# EAGLE schematic secs_q84 v2 (EAGLE 9.6.2)
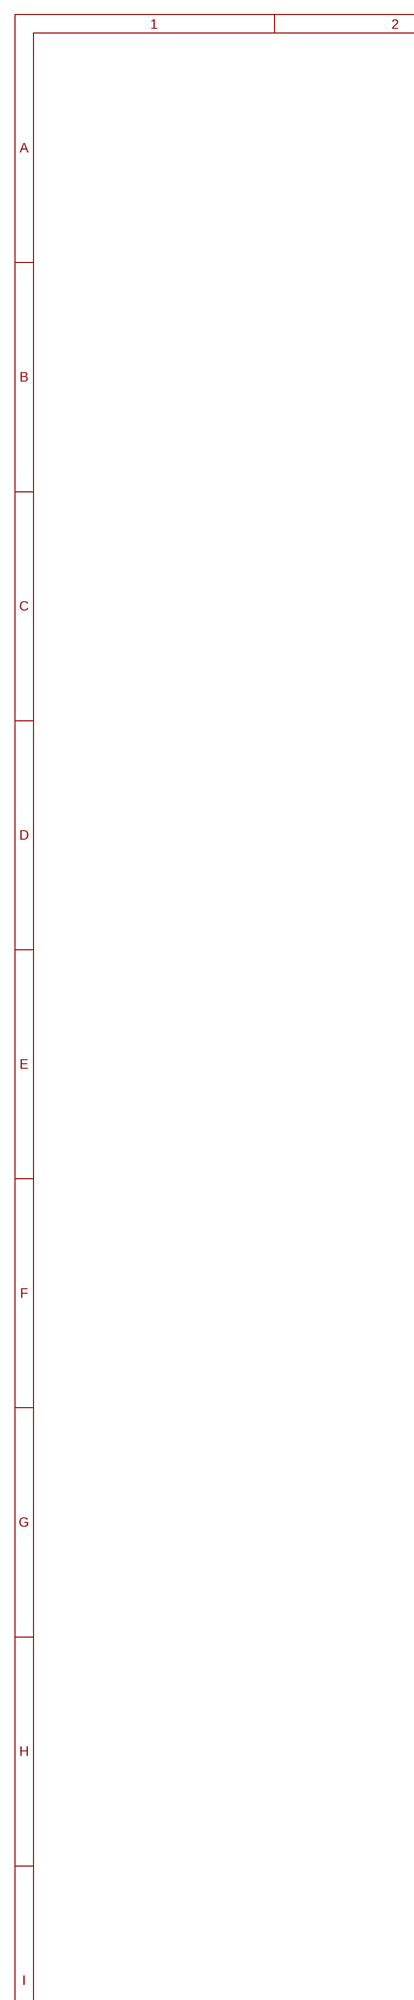
[diagram p0: schematic, sheet 1, part 1 of 2]
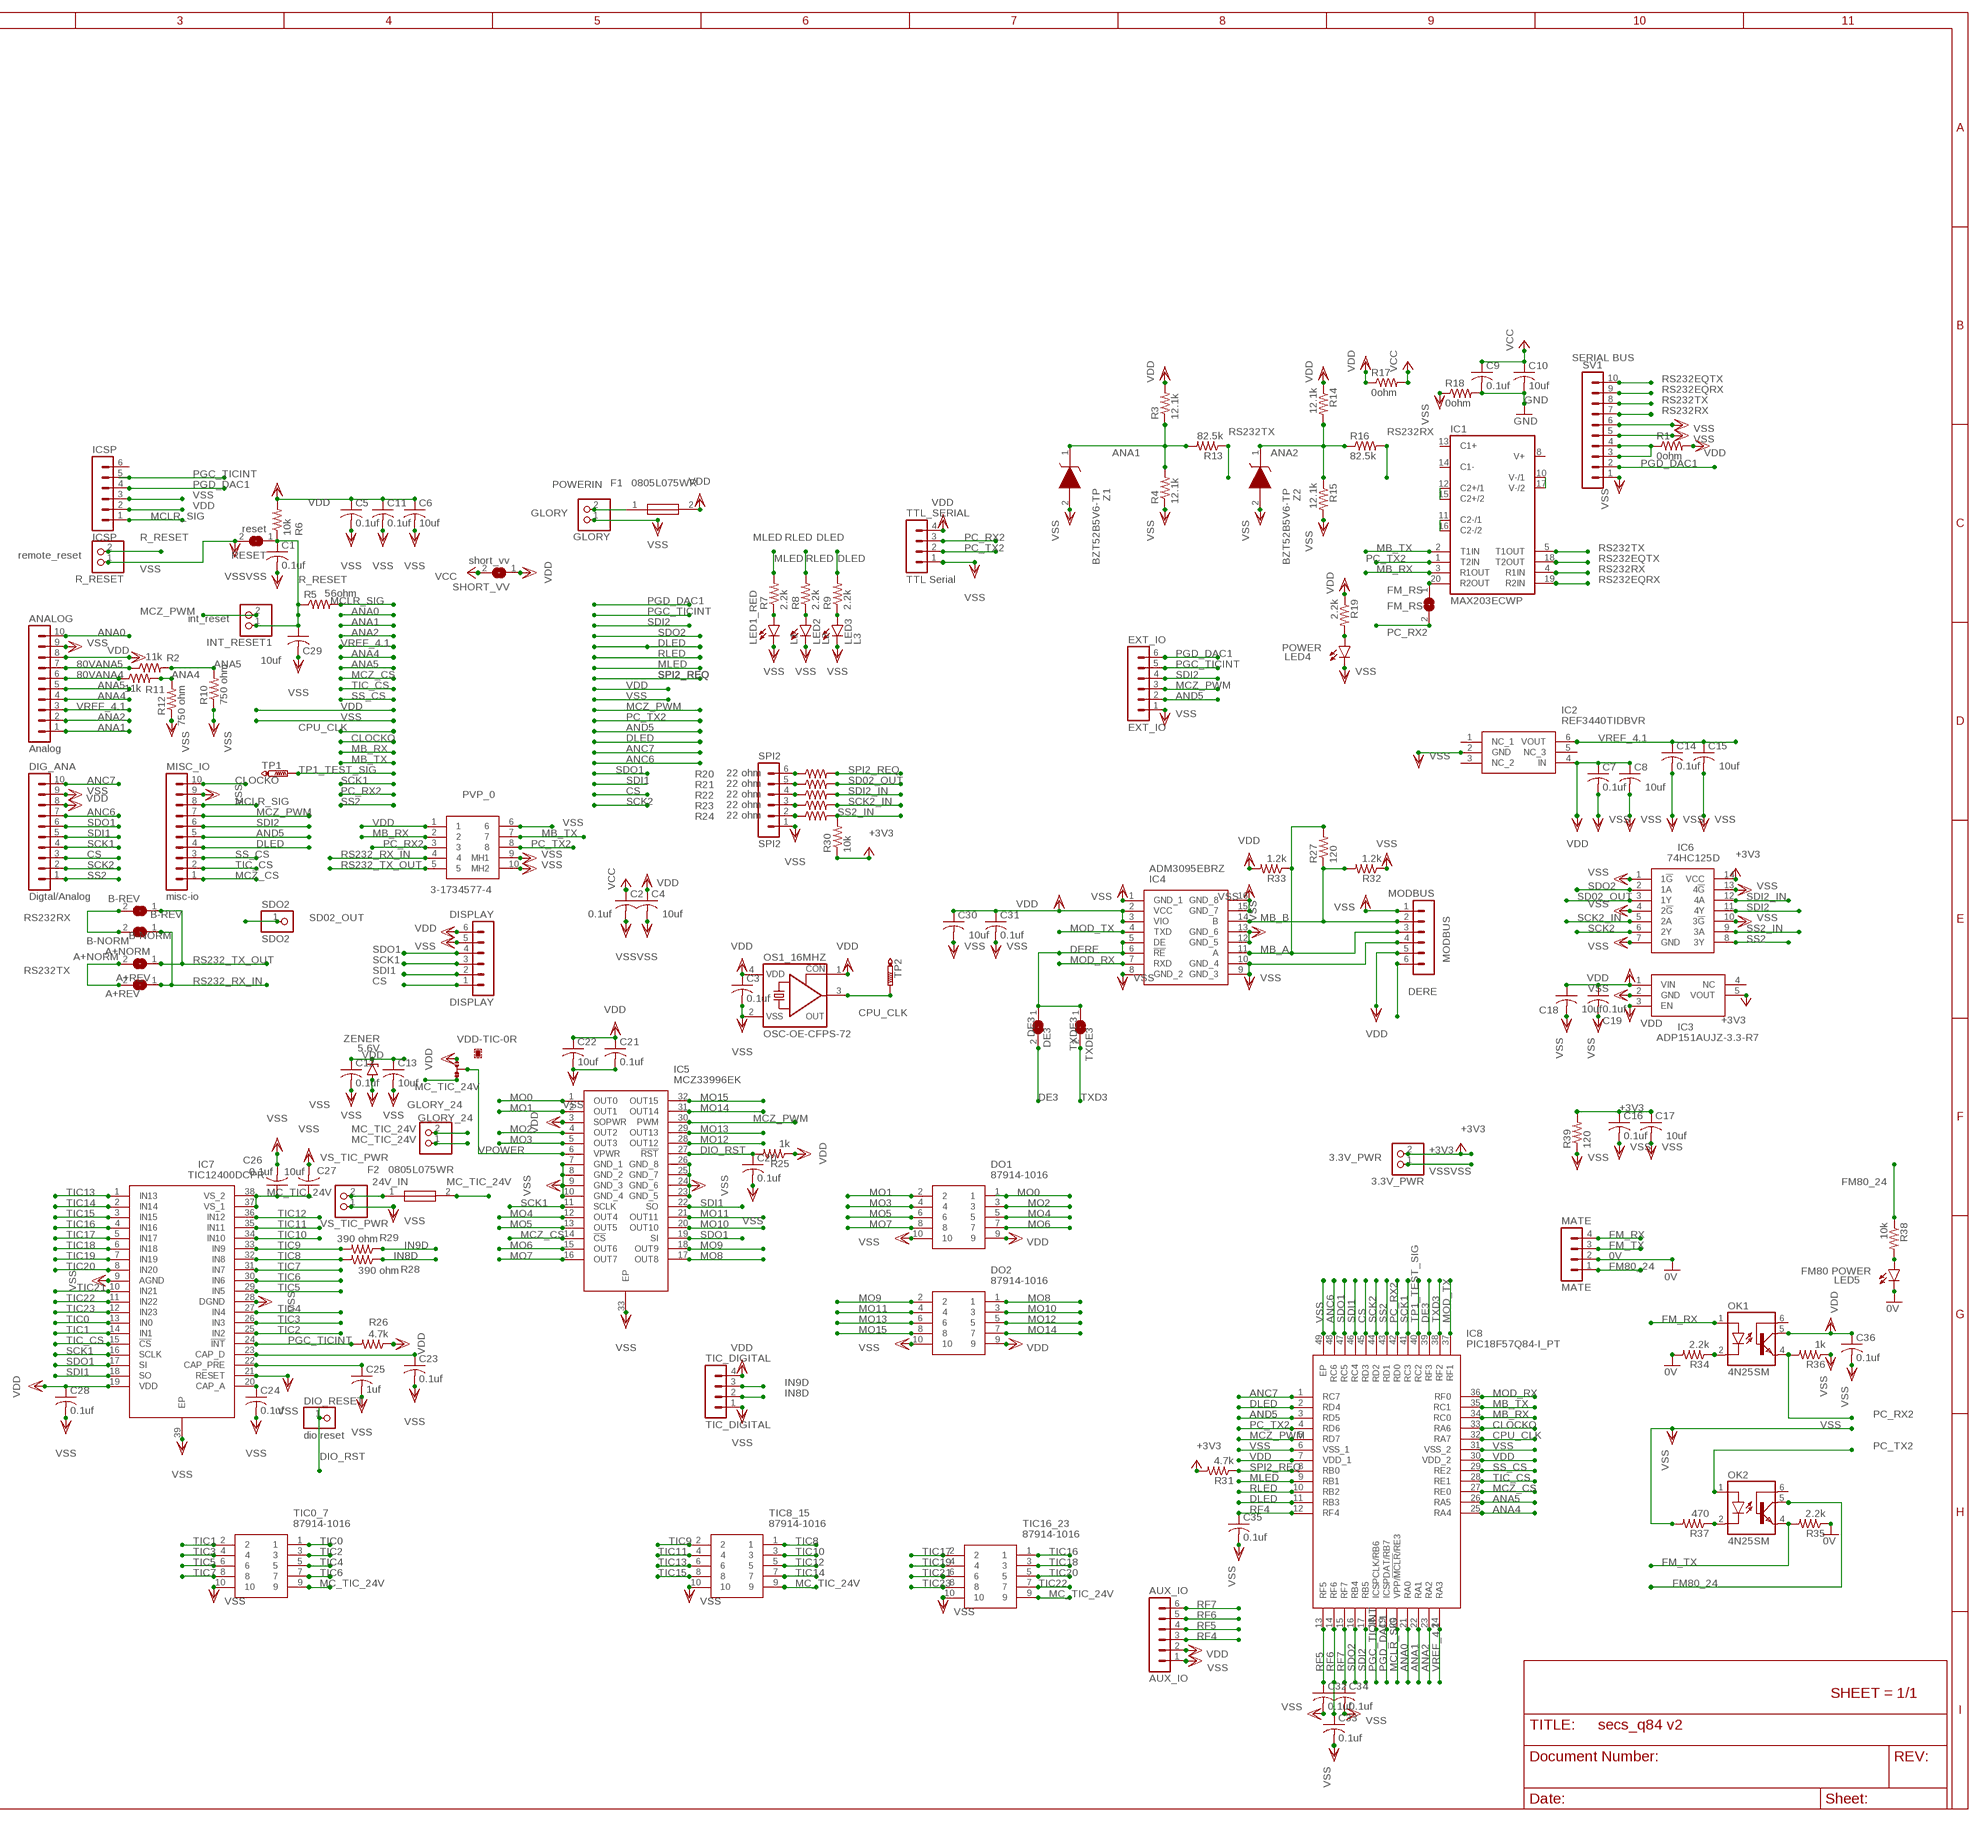
[diagram p1: schematic, sheet 1, part 2 of 2]

## Parts
3.3V_PWR  3.3V_PWR  PINHD-1X2  [1X02]
A+NORM  A+NORM  SJ  [SJ]
A+REV  A+REV  SJ  [SJ]
ANALOG  Analog  MA10-1  [MA10-1]
AUX_IO  AUX_IO  MA06-1  [MA06-1]
B-NORM  B-NORM  SJ  [SJ]
B-REV  B-REV  SJ  [SJ]
C1  0.1uf  C-USC0805  [C0805]
C2  0.1uf  C-USC0805  [C0805]
C3  0.1uf  C-USC0805  [C0805]
C4  10uf  C-USC0805  [C0805]
C5  0.1uf  C-USC0805  [C0805]
C6  10uf  C-USC0805  [C0805]
C7  0.1uf  C-USC0805  [C0805]
C8  10uf  C-USC0805  [C0805]
C9  0.1uf  C-USC0805  [C0805]
C10  10uf  C-USC0805  [C0805]
C11  0.1uf  C-USC0805  [C0805]
C12  0.1uf  C-USC0805  [C0805]
C13  10uf  C-USC0805  [C0805]
C14  0.1uf  C-USC0805  [C0805]
C15  10uf  C-USC0805  [C0805]
C16  0.1uf  C-USC0805  [C0805]
C17  10uf  C-USC0805  [C0805]
C18  10uf  C-USC0805  [C0805]
C19  0.1uf  C-USC0805  [C0805]
C20  0.1uf  C-USC0805  [C0805]
C21  0.1uf  C-USC0805  [C0805]
C22  10uf  C-USC0805  [C0805]
C23  0.1uf  C-USC0805  [C0805]
C24  0.1uf  C-USC0805  [C0805]
C25  1uf  C-USC0805  [C0805]
C26  0.1uf  C-USC0805  [C0805]
C27  10uf  C-USC0805  [C0805]
C28  0.1uf  C-USC0805  [C0805]
C29  10uf  C-USC0805  [C0805]
C30  10uf  C-USC0805  [C0805]
C31  0.1uf  C-USC0805  [C0805]
C32  0.1uf  C-USC0603  [C0603]
C33  0.1uf  C-USC0603  [C0603]
C34  0.1uf  C-USC0603  [C0603]
C35  0.1uf  C-USC0603  [C0603]
C36  0.1uf  C-USC0603  [C0603]
DE3  DE3  SJ  [SJ]
DIG_ANA  Digtal/Analog  MA10-1  [MA10-1]
DIO_RESET  dio reset  PINHD-1X1  [1X01]
DISPLAY  DISPLAY  MA06-1  [MA06-1]
DO1  87914-1016  [879141016]
DO2  87914-1016  [879141016]
EXT_IO  EXT_IO  MA06-1  [MA06-1]
F1  0805L075WR  [FUSC2114X125N]
F2  0805L075WR  [FUSC2114X125N]
FM_RS  FM_RS  SJ  [SJ]
GLORY  GLORY  PINHD-1X2  [1X02]
GLORY_24  GLORY_24  PINHD-1X2  [1X02]
IC1  MAX203ECWP  [SO20L]
IC2  REF3440TIDBVR  [SOT95P280X145-6N]
IC3  ADP151AUJZ-3.3-R7  [SOT95P280X100-5N]
IC4  ADM3095EBRZ  [SOIC127P600X175-16N]
IC5  MCZ33996EK  [SOP65P1030X265-33N]
IC6  74HC125D  [SOIC127P600X175-14N]
IC7  TIC12400DCPR  [SOP50P640X120-39N]
IC8  PIC18F57Q84-I_PT  [QFP50P900X900X120-49N]
ICSP  ICSP  MA06-1  [MA06-1]
INT_RESET1  int_reset  PINHD-1X2  [1X02]
LED1_RED  L1  LEDCHIPLED_0805  [CHIPLED_0805]
LED2  L2  LEDCHIPLED_0805  [CHIPLED_0805]
LED3  L3  LEDCHIPLED_0805  [CHIPLED_0805]
LED4  POWER  LEDCHIP-LED0603  [CHIP-LED0603]
LED5  FM80 POWER  LEDCHIP-LED0603  [CHIP-LED0603]
MATE  MATE  MA04-1  [MA04-1]
MISC_IO  misc-io  MA10-1  [MA10-1]
MODBUS  MODBUS  MA06-1  [MA06-1]
OK1  4N25SM  [DIL6-SMD]
OK2  4N25SM  [DIL6-SMD]
OS1_16MHZ  OSC-OE-CFPS-72  [7.2X5.2-4-PAD]
PVP_0  3-1734577-4  [317345774]
R1  0ohm  R-US_R0805  [R0805]
R2  11k  R-US_M1206  [M1206]
R3  12.1k  R-US_R0805  [R0805]
R4  12.1k  R-US_R0805  [R0805]
R5  56ohm  R-US_R0805  [R0805]
R6  10k  R-US_R0805  [R0805]
R7  2.2k  R-US_R0805  [R0805]
R8  2.2k  R-US_R0805  [R0805]
R9  2.2k  R-US_R0805  [R0805]
R10  750 ohm  R-US_M1206  [M1206]
R11  11k  R-US_M1206  [M1206]
R12  750 ohm  R-US_M1206  [M1206]
R13  82.5k  R-US_R0805  [R0805]
R14  12.1k  R-US_R0805  [R0805]
R15  12.1k  R-US_R0805  [R0805]
R16  82.5k  R-US_R0805  [R0805]
R17  0ohm  R-US_R0805  [R0805]
R18  0ohm  R-US_R0805  [R0805]
R19  2.2k  R-US_R0805  [R0805]
R20  22 ohm  R-US_R0805  [R0805]
R21  22 ohm  R-US_R0805  [R0805]
R22  22 ohm  R-US_R0805  [R0805]
R23  22 ohm  R-US_R0805  [R0805]
R24  22 ohm  R-US_R0805  [R0805]
R25  1k  R-US_R0805  [R0805]
R26  4.7k  R-US_R0805  [R0805]
R27  120  R-US_R0805  [R0805]
R28  390 ohm  R-US_R0805  [R0805]
R29  390 ohm  R-US_R0805  [R0805]
R30  10k  R-US_R0805  [R0805]
R31  4.7k  R-US_R0805  [R0805]
R32  1.2k  R-US_R0805  [R0805]
R33  1.2k  R-US_R0805  [R0805]
R34  2.2k  R-US_R0805  [R0805]
R35  2.2k  R-US_R0805  [R0805]
R36  1k  R-US_R0805  [R0805]
R37  470  R-US_R0805  [R0805]
R38  10k  R-US_R0805  [R0805]
R39  120  R-US_R0805  [R0805]
R_RESET  remote_reset  PINHD-1X2  [1X02]
RESET  reset  SJ  [SJ]
SDO2  SDO2  PINHD-1X1  [1X01]
SHORT_VV  short_vv  SJ  [SJ]
SPI2  SPI2  MA06-1  [MA06-1]
SV1  SERIAL BUS  MA10-1  [MA10-1]
TIC0_7  87914-1016  [879141016]
TIC8_15  87914-1016  [879141016]
TIC16_23  87914-1016  [879141016]
TIC_DIGITAL  TIC_DIGITAL  MA04-1  [MA04-1]
TP1  PTR1PAD1-13  [P1-13]
TP2  PTR1PAD1-13  [P1-13]
TTL_SERIAL  TTL Serial  MA04-1  [MA04-1]
TXDE3  TXDE3  SJ  [SJ]
VDD-TIC  0R-JUMPA  [A0R-JMP]
VS_TIC_PWR  VS_TIC_PWR  PINHD-1X2  [1X02]
Z1  BZT52B5V6-TP  [SOD3716X135N]
Z2  BZT52B5V6-TP  [SOD3716X135N]
ZENER  5.6V  ZENER-DIODESMB  [SMB]

## Nets
0V: LED5.C MATE.2 R34.2 R35.1
24V_IN [icurrent]: F2.1 VS_TIC_PWR.2
80VANA4: ANALOG.6 R11.1
80VANA5: ANALOG.7 R2.1
+3V3: 3.3V_PWR.2 C16.1 C17.1 IC3.5(VOUT) IC6.14(VCC) R30.1 R31.2 R39.2
ANA0: ANALOG.10 IC8.21(RA0)
ANA1: ANALOG.1 IC8.22(RA1) R3.1 R4.2 R13.2 Z1.1(K)
ANA2: ANALOG.2 IC8.23(RA2) R14.2 R15.1 R16.1 Z2.1(K)
ANA4: ANALOG.4 IC8.25(RA4) R11.2 R12.2
ANA5: ANALOG.5 IC8.26(RA5) R2.2 R10.2
ANC6: DIG_ANA.7 IC8.48(RC6)
ANC7: DIG_ANA.10 IC8.1(RC7)
AND5: EXT_IO.2 IC8.3(RD5) MISC_IO.5
CLOCKO: IC8.33(RA6) MISC_IO.10
CPU_CLK: IC8.32(RA7) OS1_16MHZ.3(OUT) TP2.TP
CS: DIG_ANA.3 DISPLAY.1 IC8.45(RD3)
DE3: DE3.2 IC8.39(RF3)
DERE: DE3.1 IC4.5(DE) IC4.6(!RE) MODBUS.6 TXDE3.1
DIO_RST: C20.1 DIO_RESET.1 IC5.27(!RST) R25.2
DLED: IC8.2(RD4) IC8.11(RB3) MISC_IO.4 R9.2
DPOWER [icurrent]: R1.1 SV1.3 SV1.4
FM80_24: MATE.1 OK2.5(COL) R38.1
FM_RX: MATE.4 OK1.1(A)
FM_TX: MATE.3 OK2.4(EMI) R35.2
GND [icurrent]: C9.2 C10.2 R18.2
IN8D: R28.1 TIC_DIGITAL.2
IN9D: R29.1 TIC_DIGITAL.3
MB_A: IC4.11(A) MODBUS.3 R27.2 R33.1
MB_B: IC4.14(B) MODBUS.2 R27.1 R32.2
MB_RX: IC1.3(R1OUT) IC8.34(RC0) PVP_0.2
MB_TX: IC1.2(T1IN) IC8.35(RC1) PVP_0.7
MC_TIC_24V [icurrent]: C26.1 C27.1 F2.2 GLORY_24.1 GLORY_24.2 IC7.37(VS_1) IC7.38(VS_2) TIC0_7.9 TIC8_15.9 TIC16_23.9 VDD-TIC.3
MCLR_SIG: IC8.20(VPP/!MCLR!/RE3) ICSP.1 MISC_IO.8 R5.2
MCZ_CS: IC5.14(!CS) IC8.27(RE0) MISC_IO.1
MCZ_PWM: EXT_IO.3 IC5.30(PWM) IC8.5(RD7) INT_RESET1.2 MISC_IO.7
MLED: IC8.9(RB1) R7.2
MO0 [ocurrent]: DO1.1 IC5.1(OUT0)
MO1 [ocurrent]: DO1.2 IC5.2(OUT1)
MO2 [ocurrent]: DO1.3 IC5.4(OUT2)
MO3 [ocurrent]: DO1.4 IC5.5(OUT3)
MO4 [ocurrent]: DO1.5 IC5.12(OUT4)
MO5 [ocurrent]: DO1.6 IC5.13(OUT5)
MO6 [ocurrent]: DO1.7 IC5.15(OUT6)
MO7 [ocurrent]: DO1.8 IC5.16(OUT7)
MO8 [ocurrent]: DO2.1 IC5.17(OUT8)
MO9 [ocurrent]: DO2.2 IC5.18(OUT9)
MO10 [ocurrent]: DO2.3 IC5.20(OUT10)
MO11 [ocurrent]: DO2.4 IC5.21(OUT11)
MO12 [ocurrent]: DO2.5 IC5.28(OUT12)
MO13 [ocurrent]: DO2.6 IC5.29(OUT13)
MO14 [ocurrent]: DO2.7 IC5.31(OUT14)
MO15 [ocurrent]: DO2.8 IC5.32(OUT15)
MOD_RX: IC4.7(RXD) IC8.36(RF0)
MOD_TX: IC4.4(TXD) IC8.37(RF1)
N$1: IC1.10(V-/1) IC1.17(V-/2)
N$2: IC1.12(C2+/1) IC1.15(C2+/2)
N$3: LED4.A R19.2
N$4: LED1_RED.A R7.1
N$5: LED2.A R8.1
N$6: LED3.A R9.1
N$7: IC1.11(C2-/1) IC1.16(C2-/2)
N$8: R20.1 SPI2.6
N$9: R21.1 SPI2.5
N$10: R22.1 SPI2.4
N$11: R23.1 SPI2.3
N$12: R24.1 SPI2.2
N$13: FM_RS.1 IC1.20(R2OUT)
N$14: OK1.2(C) R34.1
N$15: LED5.A R38.2
N$17: OK2.2(C) R37.1
N$30: C23.1 IC7.23(CAP_D)
N$31: C25.1 IC7.22(CAP_PRE)
N$32: C24.1 IC7.20(CAP_A)
PC_RX2: FM_RS.2 IC8.42(RD0) OK1.4(EMI) PVP_0.3 R36.2 TTL_SERIAL.3
PC_TX2: IC1.1(T2IN) IC8.4(RD6) OK2.1(A) PVP_0.8 TTL_SERIAL.2
PGC_TICINT: EXT_IO.5 IC7.24(!INT) IC8.18(ICSPCLK/RB6) ICSP.5 R26.2
PGD_DAC1: EXT_IO.6 IC8.19(ICSPDAT/RB7) ICSP.4 SV1.2
POWERIN [icurrent]: F1.1 GLORY.2
R_RESET: C1.1 C29.1 INT_RESET1.1 R5.1 R6.1 R_RESET.2 RESET.1
RF4: AUX_IO.3 C35.1 IC8.12(RF4)
RF5: AUX_IO.4 C32.1 IC8.13(RF5)
RF6: AUX_IO.5 C33.1 IC8.14(RF6)
RF7: AUX_IO.6 C34.1 IC8.15(RF7)
RLED: IC8.10(RB2) R8.2
RS232_RX_IN: A+REV.1 B-NORM.1 PVP_0.4
RS232_TX_OUT: A+NORM.1 B-REV.1 PVP_0.5
RS232EQRX: IC1.19(R2IN) SV1.9
RS232EQTX: IC1.18(T2OUT) SV1.10
RS232RX: B-NORM.2 B-REV.2 IC1.4(R1IN) R16.2 SV1.7
RS232TX: A+NORM.2 A+REV.2 IC1.5(T1OUT) R13.1 SV1.8
SCK1: DIG_ANA.4 DISPLAY.3 IC5.11(SCLK) IC7.16(SCLK) IC8.41(RC3)
SCK2: DIG_ANA.2 IC6.6(2Y) IC8.44(RD2)
SCK2_IN: IC6.5(2A) R23.2
SD02_OUT: IC6.3(1Y) R21.2 SDO2.1
SDI1: DIG_ANA.5 DISPLAY.2 IC5.22(SO) IC7.18(SO) IC8.46(RC4)
SDI2: EXT_IO.4 IC6.11(4Y) IC8.17(RB5) MISC_IO.6
SDI2_IN: IC6.12(4A) R22.2
SDO1: DIG_ANA.6 DISPLAY.4 IC5.19(SI) IC7.17(SI) IC8.47(RC5)
SDO2: IC6.2(1A) IC8.16(RB4)
SPI2_REQ: IC8.8(RB0) R20.2 R31.1
SS2: DIG_ANA.1 IC6.8(3Y) IC8.43(RD1)
SS2_IN: IC6.9(3A) R24.2 R30.2
SS_CS: IC8.29(RE2) MISC_IO.3
TIC0: IC7.13(IN0) TIC0_7.1
TIC1: IC7.14(IN1) TIC0_7.2
TIC2: IC7.25(IN2) TIC0_7.3
TIC3: IC7.26(IN3) TIC0_7.4
TIC4: IC7.27(IN4) TIC0_7.5
TIC5: IC7.29(IN5) TIC0_7.6
TIC6: IC7.30(IN6) TIC0_7.7
TIC7: IC7.31(IN7) TIC0_7.8
TIC8: IC7.32(IN8) R28.2 TIC8_15.1
TIC9: IC7.33(IN9) R29.2 TIC8_15.2
TIC10: IC7.34(IN10) TIC8_15.3
TIC11: IC7.35(IN11) TIC8_15.4
TIC12: IC7.36(IN12) TIC8_15.5
TIC13: IC7.1(IN13) TIC8_15.6
TIC14: IC7.2(IN14) TIC8_15.7
TIC15: IC7.3(IN15) TIC8_15.8
TIC16: IC7.4(IN16) TIC16_23.1
TIC17: IC7.5(IN17) TIC16_23.2
TIC18: IC7.6(IN18) TIC16_23.3
TIC19: IC7.7(IN19) TIC16_23.4
TIC20: IC7.8(IN20) TIC16_23.5
TIC21: IC7.10(IN21) TIC16_23.6
TIC22: IC7.11(IN22) TIC16_23.7
TIC23: IC7.12(IN23) TIC16_23.8
TIC_CS: IC7.15(!CS) IC8.28(RE1) MISC_IO.2
TP1_TEST_SIG: IC8.40(RC2) TP1.TP
TXD3: IC8.38(RF2) TXDE3.2
VCC [icurrent]: C2.1 C9.1 C10.1 R17.2 SHORT_VV.2
VDD [icurrent]: ANALOG.8 AUX_IO.2 C3.1 C4.1 C5.1 C6.1 C7.1 C8.1 C11.1 C12.1 C13.1 C18.1 C19.1 C21.1 C22.1 C28.1 C30.1 C31.1 C36.1 DIG_ANA.8 DISPLAY.6 DO1.9 DO2.9 F1.2 IC2.4(IN) IC3.1(VIN) IC3.3(EN) IC4.2(VCC) IC4.3(VIO) IC5.3(SOPWR) IC7.19(VDD) IC8.7(VDD_1) IC8.30(VDD_2) ICSP.2 MODBUS.5 OK1.5(COL) OS1_16MHZ.1(CON) OS1_16MHZ.4(VDD) PVP_0.1 R1.2 R3.2 R6.2 R14.1 R17.1 R19.1 R25.1 R26.1 R33.2 SHORT_VV.1 TIC_DIGITAL.4 TTL_SERIAL.4 VDD-TIC.1 ZENER.C
VPOWER [icurrent]: IC5.6(VPWR) VDD-TIC.2
VREF_4.1: ANALOG.3 C14.1 C15.1 IC2.6(VOUT) IC8.24(RA3)
VSS [icurrent]: 3.3V_PWR.1 ANALOG.9 AUX_IO.1 C1.2 C2.2 C3.2 C4.2 C5.2 C6.2 C7.2 C8.2 C11.2 C12.2 C13.2 C14.2 C15.2 C16.2 C17.2 C18.2 C19.2 C20.2 C21.2 C22.2 C23.2 C24.2 C25.2 C26.2 C27.2 C28.2 C29.2 C30.2 C31.2 C32.2 C33.2 C34.2 C35.2 C36.2 DIG_ANA.9 DISPLAY.5 DO1.10 DO2.10 EXT_IO.1 GLORY.1 IC2.2(GND) IC3.2(GND) IC4.1(GND_1) IC4.8(GND_2) IC4.9(GND_3) IC4.10(GND_4) IC4.12(GND_5) IC4.13(GND_6) IC4.15(GND_7) IC4.16(GND_8) IC5.7(GND_1) IC5.8(GND_2) IC5.9(GND_3) IC5.10(GND_4) IC5.23(GND_5) IC5.24(GND_6) IC5.25(GND_7) IC5.26(GND_8) IC5.33(EP) IC6.1(1!G) IC6.4(2!G) IC6.7(GND) IC6.10(3!G) IC6.13(4!G) IC7.9(AGND) IC7.21(RESET) IC7.28(DGND) IC7.39(EP) IC8.6(VSS_1) IC8.31(VSS_2) IC8.49(EP) ICSP.3 LED1_RED.C LED2.C LED3.C LED4.C MISC_IO.9 MODBUS.1 MODBUS.4 OS1_16MHZ.2(VSS) PVP_0.6 PVP_0.9(MH1) PVP_0.10(MH2) R4.1 R10.1 R12.1 R15.2 R18.1 R32.1 R36.1 R37.2 R39.1 R_RESET.1 RESET.2 SPI2.1 SV1.1 SV1.5 SV1.6 TIC0_7.10 TIC8_15.10 TIC16_23.10 TIC_DIGITAL.1 TTL_SERIAL.1 VS_TIC_PWR.1 Z1.2(A) Z2.2(A) ZENER.A
Unconnected: IC1.8(V+) IC1.13(C1+) IC1.14(C1-) IC2.1(NC_1) IC2.3(NC_2) IC2.5(NC_3) IC3.4(NC) ICSP.6 OK1.6(BAS) OK2.6(BAS)

## Power pins joined to a net without a drawn wire
GND: IC1.6(GND) IC1.9(GND)
VCC: IC1.7(VCC)

## Library data of the parts
3.3V_PWR GLORY GLORY_24 INT_RESET1 R_RESET VS_TIC_PWR = pinhead:PINHD-1X2: PIN HEADER
A+NORM A+REV B-NORM B-REV DE3 FM_RS RESET SHORT_VV TXDE3 = jumper:SJ: SMD solder JUMPER
ANALOG DIG_ANA MISC_IO SV1 = con-lstb:MA10-1: PIN HEADER; OC_FARNELL: unknown; OC_NEWARK: unknown
AUX_IO DISPLAY EXT_IO ICSP MODBUS SPI2 = con-lstb:MA06-1: PIN HEADER; OC_FARNELL: unknown; OC_NEWARK: unknown
C1-C36 = rcl:C-US: CAPACITOR, American symbol; SPICEPREFIX: C
DIO_RESET SDO2 = pinhead:PINHD-1X1: PIN HEADER
DO1 DO2 TIC0_7 TIC8_15 TIC16_23 = 87914-1016:87914-1016: 2.54mm Pitch C-Grid Header, Through Hole, Dual Row, Vertical, 10 Circuits, 2.50m Tin (Sn) Overall Plating, Tray Packaging, Lead-Free Source: Datasheet <https://www.molex.com/content/dam/molex/molex-dot-com/products/automated/en-us/salesdrawingpdf/879/87914/879141016_sd.pdf>; DESCRIPTION: 2.54mm Pitch C-Grid Header, Through Hole, Dual Row, Vertical, 10 Circuits, 2.50m Tin (Sn) Overall Plating, Tray Packaging, Lead-Free; HEIGHT: 8.33mm; MANUFACTURER_NAME: Molex; MANUFACTURER_PART_NUMBER: 87914-1016; MOUSER_PART_NUMBER: 538-87914-1016; MOUSER_PRICE-STOCK: https://www.mouser.co.uk/ProductDetail/Molex/87914-1016?qs=kNSQ05%252BLZoC4mX3noaPXJg%3D%3D
F1 F2 = 0805L075WR:0805L075WR: PTC Resettable Fuse 0.75A(hold) 1.5A(trip) 6VDC 40A 0.6W 0.2s 0.09Ohm SMD Solder Pad 0805 T/R Source: Datasheet <https://www.arrow.com/en/products/0805l075wr/littelfuse>; DESCRIPTION: PTC Resettable Fuse 0.75A(hold) 1.5A(trip) 6VDC 40A 0.6W 0.2s 0.09Ohm SMD Solder Pad 0805 T/R; HEIGHT: 1.25mm; MANUFACTURER_NAME: LITTELFUSE; MANUFACTURER_PART_NUMBER: 0805L075WR; MOUSER_PART_NUMBER: 576-0805L075WR; MOUSER_PRICE-STOCK: https://www.mouser.co.uk/ProductDetail/Littelfuse/0805L075WR?qs=gOdenYySUw5wkBcmg2CY4A%3D%3D
IC1 = maxim:MAX203ECWP: RS232 TRANSCEIVER; MPN: MAX203ECWP+G36; OC_FARNELL: 1224204; OC_NEWARK: 89K3435
IC2 = REF3440TIDBVR:REF3440TIDBVR: Voltage References 4.1-V, low-drift, low-power, small-footprint series voltage reference Source: Datasheet <https://www.ti.com/lit/ds/symlink/ref3425.pdf?ts=1626722188647>; DESCRIPTION: Voltage References 4.1-V, low-drift, low-power, small-footprint series voltage reference; HEIGHT: 1.45mm; MANUFACTURER_NAME: Texas Instruments; MANUFACTURER_PART_NUMBER: REF3440TIDBVR; MOUSER_PART_NUMBER: 595-REF3440TIDBVR; MOUSER_PRICE-STOCK: https://www.mouser.co.uk/ProductDetail/Texas-Instruments/REF3440TIDBVR?qs=aP1CjGhiNiFrJEFwygVNiw%3D%3D
IC3 = ADP151AUJZ-3.3-R7:ADP151AUJZ-3.3-R7: Analog Devices ADP151AUJZ-3.3-R7, Single Linear Voltage Regulator, 200mA 3.3 V, +/-2.5%, 5-Pin TSOT Source: Datasheet <https://componentsearchengine.com/Datasheets/2/ADP151AUJZ-3.3-R7.pdf>; DESCRIPTION: Analog Devices ADP151AUJZ-3.3-R7, Single Linear Voltage Regulator, 200mA 3.3 V, +/-2.5%, 5-Pin TSOT; HEIGHT: 1mm; MANUFACTURER_NAME: Analog Devices; MANUFACTURER_PART_NUMBER: ADP151AUJZ-3.3-R7; MOUSER_PART_NUMBER: 584-ADP151AUJZ-3.3R7; MOUSER_PRICE-STOCK: https://www.mouser.co.uk/ProductDetail/Analog-Devices/ADP151AUJZ-3.3-R7?qs=WIvQP4zGanide73FjU7r2Q%3D%3D
IC4 = ADM3095EBRZ:ADM3095EBRZ: Level 4 EMC Protected RS-485 Transceiver with Full +/-42 V Fault Protection Source: Datasheet <https://componentsearchengine.com/Datasheets/1/ADM3095EBRZ.pdf>; DESCRIPTION: Level 4 EMC Protected RS-485 Transceiver with Full +/-42 V Fault Protection; HEIGHT: 1.75mm; MANUFACTURER_NAME: Analog Devices; MANUFACTURER_PART_NUMBER: ADM3095EBRZ; MOUSER_PART_NUMBER: 584-ADM3095EBRZ; MOUSER_PRICE-STOCK: https://www.mouser.com/Search/Refine.aspx?Keyword=584-ADM3095EBRZ
IC5 = MCZ33996EK:MCZ33996EK: NXP - MCZ33996EK - LOAD SWITCH, 16 O/P, 24 BIT SPI, 32WSOIC Source: Datasheet <http://www.nxp.com/docs/en/data-sheet/MC33996.pdf>; DESCRIPTION: NXP - MCZ33996EK - LOAD SWITCH, 16 O/P, 24 BIT SPI, 32WSOIC; HEIGHT: 2.65mm; MANUFACTURER_NAME: NXP; MANUFACTURER_PART_NUMBER: MCZ33996EK; MOUSER_PART_NUMBER: 841-MCZ33996EK; MOUSER_PRICE-STOCK: https://www.mouser.co.uk/ProductDetail/NXP-Semiconductors/MCZ33996EK?qs=YvTEJ%2FLhu6WGqZqm9W%252Bwzw%3D%3D
IC6 = 74HC125D:74HC125D: Quad Bus Buffer, Non-Inverted 3-State Outputs CMOS Digital Integrated Circuits Silicon Monolithic : SOIC14 Source: Datasheet <https://toshiba.semicon-storage.com/info/docget.jsp?did=37028&prodName=74HC125D>; DESCRIPTION: Quad Bus Buffer, Non-Inverted 3-State Outputs CMOS Digital Integrated Circuits Silicon Monolithic : SOIC14; HEIGHT: 1.75mm; MANUFACTURER_NAME: Toshiba; MANUFACTURER_PART_NUMBER: 74HC125D; MOUSER_PART_NUMBER: 757-74HC125D; MOUSER_PRICE-STOCK: https://www.mouser.co.uk/ProductDetail/Toshiba/74HC125D?qs=7EBvPakHacXdKF96aoPC3w%3D%3D; SIMULATION_DATA: https://toshiba.semicon-storage.com/info/docget.jsp?did=53014&prodName=74HC125D&displang=en&returnFlg=true
IC7 = TIC12400DCPR:TIC12400DCPR: 24-Input Sensor Monitor With SPI Interface Source: Datasheet <http://www.ti.com/lit/gpn/tic12400>; DESCRIPTION: 24-Input Sensor Monitor With SPI Interface; HEIGHT: 1.2mm; MANUFACTURER_NAME: Texas Instruments; MANUFACTURER_PART_NUMBER: TIC12400DCPR; MOUSER_PART_NUMBER: 595-TIC12400DCPR; MOUSER_PRICE-STOCK: https://www.mouser.co.uk/ProductDetail/Texas-Instruments/TIC12400DCPR?qs=1mbolxNpo8eZDVFvCZLlfw%3D%3D
IC8 = PIC18F57Q84-I_PT:PIC18F57Q84-I_PT: 8-bit Microcontrollers - MCU Source: Datasheet <https://ww1.microchip.com/downloads/en/DeviceDoc/PIC18F27-47-57Q84-Data-Sheet-DS40002213C.pdf>; DESCRIPTION: 8-bit Microcontrollers - MCU; HEIGHT: 1.2mm; MANUFACTURER_NAME: Microchip; MANUFACTURER_PART_NUMBER: PIC18F57Q84-I/PT; MOUSER_PART_NUMBER: 579-PIC18F57Q84-I/PT; MOUSER_PRICE-STOCK: https://www.mouser.co.uk/ProductDetail/Microchip-Technology/PIC18F57Q84-I-PT?qs=7MVldsJ5UayIDNqU9mUkng%3D%3D
LED1_RED LED2-LED5 = led:LED: LED OSRAM: - CHIPLED LG R971, LG N971, LY N971, LG Q971, LY Q971, LO R971, LY R971 LH N974, LH R974 LS Q976, LO Q976, LY Q976 LO Q996 - Hyper CHIPLED LW Q18S LB Q993, LB Q99A, LB R99A - SideLED LS A670, LO A670, LY A670, LG A670, LP A670 LB A673, LV A673, LT A673, LW A673 LH A674 LY A675 LS A676, LA A676, LO A676, LY A676, LW A676 LS A679, LY A679, LG A679 - Hyper Micro SIDELED® LS Y876, LA Y876, LO Y876, LY Y876 LT Y87S - SmartLED LW L88C, LW L88S LB L89C, LB L89S, LG L890 LS L89K, LO L89K, LY L89K LS L896, LA L896, LO L896, LY L896 - TOPLED LS T670, LO T670, LY T670, LG T670, LP T670 LSG T670, LSP T670, LSY T670, LOP T670, LYG T670 LG T671, LOG T671, LSG T671 LB T673, LV T673, LT T673, LW T673 LH T674 LS T676, LA T676, LO T676, LY T676, LB T676, LH T676, LSB T676, LW T676 LB T67C, LV T67C, LT T67C, LS T67K, LO T67K, LY T67K, LW E67C LS E67B, LA E67B, LO E67B, LY E67B, LB E67C, LV E67C, LT E67C LW T67C LS T679, LY T679, LG T679 LS T770, LO T770, LY T770, LG T770, LP T770 LB T773, LV T773, LT T773, LW T773 LH T774 LS E675, LA E675, LY E675, LS T675 LS T776, LA T776, LO T776, LY T776, LB T776 LHGB T686 LT T68C, LB T68C - Hyper Mini TOPLED® LB M676 - Mini TOPLED Santana® LG M470 LS M47K, LO M47K, LY M47K Source: http://www.osram.convergy.de LUXEON: - LUMILED® LXK2-PW12-R00, LXK2-PW12-S00, LXK2-PW14-U00, LXK2-PW14-V00 LXK2-PM12-R00, LXK2-PM12-S00, LXK2-PM14-U00 LXK2-PE12-Q00, LXK2-PE12-R00, LXK2-PE12-S00, LXK2-PE14-T00, LXK2-PE14-U00 LXK2-PB12-K00, LXK2-PB12-L00, LXK2-PB12-M00, LXK2-PB14-N00, LXK2-PB14-P00, LXK2-PB14-Q00 LXK2-PR12-L00, LXK2-PR12-M00, LXK2-PR14-Q00, LXK2-PR14-R00 LXK2-PD12-Q00, LXK2-PD12-R00, LXK2-PD12-S00 LXK2-PH12-R00, LXK2-PH12-S00 LXK2-PL12-P00, LXK2-PL12-Q00, LXK2-PL12-R00 Source: www.luxeon.com KINGBRIGHT: KA-3528ASYC Source: www.kingbright.com
MATE TIC_DIGITAL TTL_SERIAL = con-lstb:MA04-1: PIN HEADER; OC_FARNELL: unknown; OC_NEWARK: unknown
OK1 OK2 = optocoupler:4N*?M: General Purpose 6-Pin Phototransistor Optocouplers Source: http://www.fairchildsemi.com/ds/4N/4N35-M.pdf; MF: FAIRCHILD SEMICONDUCTOR; MPN: 4N25SM; OC_FARNELL: 1021152; OC_NEWARK: 34C2020
OS1_16MHZ = IQD-Frequency-Products:OSC-OE: OSCILLATOR WITH OE
PVP_0 = 3-1734577-4:3-1734577-4: RJ45 Connector, Single Port, 1 x 1, Standard Connector Contact Density, Jack, Shielded, Cat 3, Standard - Latch Down, 8 Position, Standard Profile Source: Datasheet <https://www.te.com/commerce/DocumentDelivery/DDEController?Action=showdoc&DocId=Customer Drawing1734577D1pdfEnglishENG_CD_1734577_D1.pdf3-1734577-4>; DESCRIPTION: RJ45 Connector, Single Port, 1 x 1, Standard Connector Contact Density, Jack, Shielded, Cat 3, Standard - Latch Down, 8 Position, Standard Profile; HEIGHT: 16.8mm; MANUFACTURER_NAME: TE Connectivity; MANUFACTURER_PART_NUMBER: 3-1734577-4; MOUSER_PART_NUMBER: 571-3-1734577-4; MOUSER_PRICE-STOCK: https://www.mouser.co.uk/ProductDetail/TE-Connectivity-AMP/3-1734577-4?qs=Z4JOKa0a9TUSCOA052xCCw%3D%3D
R1-R39 = rcl:R-US_: RESISTOR, American symbol; SPICEPREFIX: R
TP1 TP2 = testpad:PTR1: TEST PIN
VDD-TIC = jump-0r-smd:0R-JUMP: SMD 0R 0805 Jumper
Z1 Z2 = BZT52B5V6-TP:BZT52B5V6-TP: Zener Diodes Source: Datasheet <https://componentsearchengine.com/Datasheets/1/BZT52B5V6-TP.pdf>; DESCRIPTION: Zener Diodes; HEIGHT: 1.35mm; MANUFACTURER_NAME: MCC; MANUFACTURER_PART_NUMBER: BZT52B5V6-TP; MOUSER_PART_NUMBER: 833-BZT52B5V6-TP; MOUSER_PRICE-STOCK: https://www.mouser.com/Search/Refine.aspx?Keyword=833-BZT52B5V6-TP
ZENER = diode:ZENER-DIODE: Z-Diode

## Net classes
1 icurrent: width 0.254 mm
2 ocurrent: width 0.203 mm